# EasyEDA schematic tm-duplicator.json
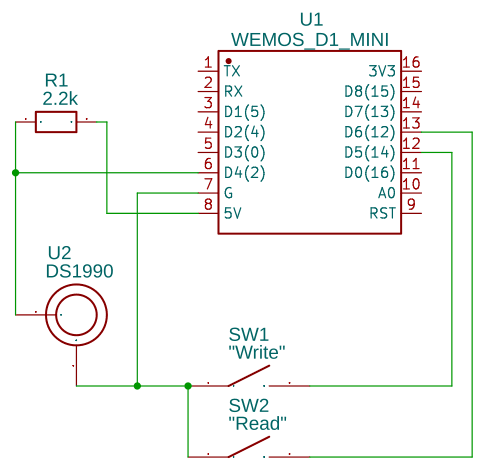
[diagram p0: schematic sheet]

## Parts
R1  2.2k  [R0603]
SW1  "Write"  [BUTTON]
SW2  "Read"  [BUTTON]
U1  WEMOS_D1_MINI  [DIP-16_WEMOS_D1_MINI_PRO4]
U2  DS1990

## Library data of the parts
R1 = R_0603_EU: Contributor: LCEDA_Lib
SW1 SW2 = PUSH BTM: Manufacturer Part: Button; Contributor: aypetrov
U1 = WEMOS_D1_MINI_PRO4: Supplier: LCSC; Supplier Part: C2837266; Manufacturer: null; Manufacturer Part: Wemos_D1_mini_Pro4; Contributor: LCSC; JLCPCB Part Class: Extended Part
U2 = DS1990: Contributor: AMertens

## Nets
Net-(R1-1): R1.1 U1.6(D4(2)) U2.1
Net-(R1-2): R1.2 U1.8(5V)
Net-(SW1-1): SW1.1 SW2.1 U1.7(G) U2.2
Net-(SW1-2): SW1.2 U1.12(D5(14))
Net-(SW2-2): SW2.2 U1.13(D6(12))

Not connected (* = marked no-connect by the designer): U1 1(TX) 2(RX) 3(D1(5)) 4(D2(4)) 5(D3(0)) 9(RST) 10(A0) 11(D0(16)) 14(D7(13)) 15(D8(15)) 16(3V3)
